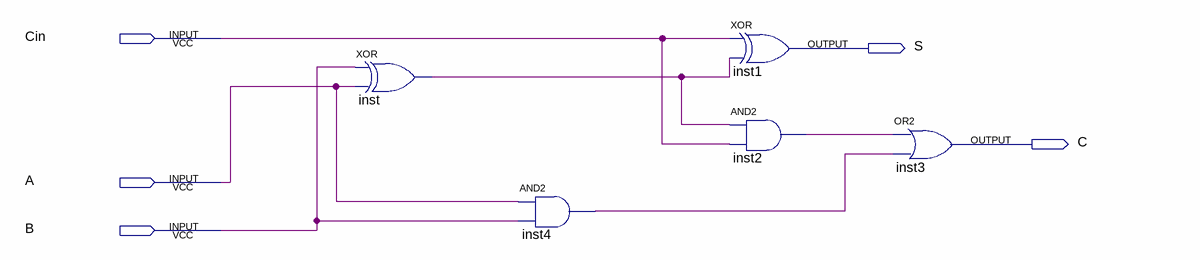
[diagram p0: schematic sheet]
// Quartus schematic somador1bit.bdf as structural Verilog: 5 symbols, 5 pins
module somador1bit (
  input  Cin,
  input  A,
  input  B,
  output S,
  output C
);

  wire inst2_out, inst4_out, inst_out;

  xor inst (inst_out, B, A);
  and inst4 (inst4_out, A, B);
  xor inst1 (S, Cin, inst_out);
  and inst2 (inst2_out, inst_out, Cin);
  or inst3 (C, inst2_out, inst4_out);
endmodule
